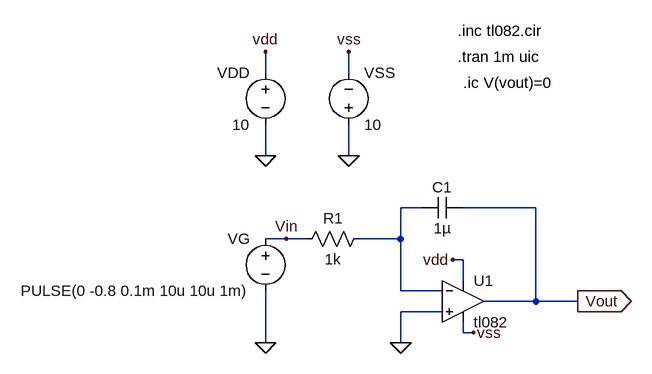
[diagram p0: schematic Response_step_Integrator.asc]
Response_step_Integrator.asc, the LTspice schematic file:
Version 4
SHEET 1 948 680
WIRE -64 -176 -64 -208
WIRE 64 -176 64 -208
WIRE -64 -48 -64 -96
WIRE 64 -48 64 -96
WIRE 176 32 144 32
WIRE 352 32 240 32
WIRE -32 80 -64 80
WIRE 0 80 -32 80
WIRE 144 80 144 32
WIRE 144 80 80 80
WIRE 240 112 224 112
WIRE 240 144 240 112
WIRE 144 160 144 80
WIRE 208 160 144 160
WIRE 352 176 352 32
WIRE 352 176 272 176
WIRE 416 176 352 176
WIRE 208 192 144 192
WIRE 240 224 240 208
WIRE 256 224 240 224
WIRE -64 240 -64 160
WIRE 144 240 144 192
FLAG -64 -48 0
FLAG 64 -48 0
FLAG -64 -208 vdd
FLAG 224 112 vdd
FLAG 64 -208 vss
FLAG 256 224 vss
FLAG 144 240 0
FLAG -64 240 0
FLAG -32 80 Vin
FLAG 416 176 Vout
IOPIN 416 176 Out
SYMBOL voltage -64 64 M0
WINDOW 123 24 124 Left 2
WINDOW 39 0 0 Left 2
SYMATTR InstName VG
SYMATTR Value PULSE(0 -0.8 0.1m 10u 10u 1m)
SYMBOL voltage -64 -192 M0
SYMATTR InstName VDD
SYMATTR Value 10
SYMBOL voltage 64 -80 M180
WINDOW 0 24 96 Left 2
WINDOW 3 24 16 Left 2
SYMATTR InstName VSS
SYMATTR Value 10
SYMBOL Opamps\\opamp2 240 112 R0
SYMATTR InstName U1
SYMATTR Value tl082
SYMBOL cap 240 16 R90
WINDOW 0 0 32 VBottom 2
WINDOW 3 32 32 VTop 2
SYMATTR InstName C1
SYMATTR Value 1µ
SYMBOL res 96 64 R90
WINDOW 0 0 56 VBottom 2
WINDOW 3 32 56 VTop 2
SYMATTR InstName R1
SYMATTR Value 1k
TEXT 232 -240 Left 2 !.inc tl082.cir
TEXT 232 -200 Left 2 !.tran 1m uic
TEXT 240 -160 Left 2 !.ic V(vout)=0

The netlist it stands for:
* Response_step_Integrator.asc
VG Vin 0 PULSE(0 -0.8 0.1m 10u 10u 1m)
VDD vdd 0 10
VSS 0 vss 10
XU1 0 N001 vdd vss Vout tl082  ; pins In+ In- V+ V- OUT
C1 Vout N001 1µ
R1 N001 Vin 1k
.inc tl082.cir
.tran 1m uic
.ic V(vout)=0
.backanno
.end